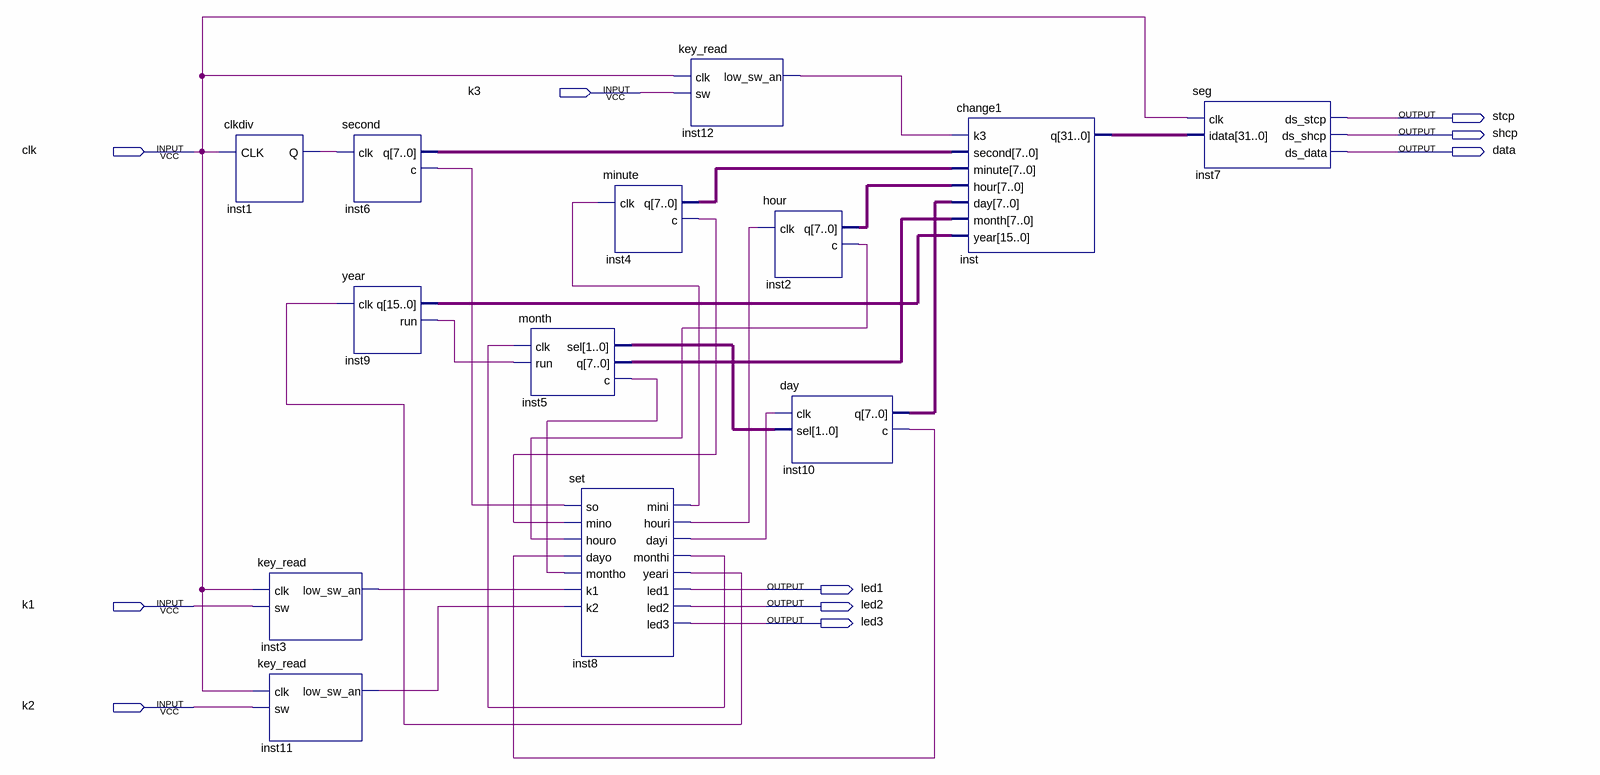
[diagram p0: schematic sheet]
// Quartus schematic clkdiv.bdf as structural Verilog: 13 symbols, 10 pins
module clkdiv (
  input  k3,
  input  clk,
  input  k1,
  input  k2,
  output stcp,
  output shcp,
  output data,
  output led1,
  output led2,
  output led3
);

  wire inst1_q, inst2_c, inst3_low_sw_an, inst4_c, inst5_c, inst6_c, inst8_dayi, inst8_houri, inst8_mini,
       inst8_monthi, inst8_yeari, inst9_run, inst10_c, inst11_low_sw_an, inst12_low_sw_an;
  wire [1:0] inst5_sel;
  wire [7:0] inst2_q, inst4_q, inst5_q, inst6_q, inst10_q;
  wire [15:0] inst9_q;
  wire [31:0] inst_q;

  clkdiv inst1 (.CLK(clk), .Q(inst1_q));
  key_read inst3 (.clk(clk), .sw(k1), .low_sw_an(inst3_low_sw_an));
  key_read inst11 (.clk(clk), .sw(k2), .low_sw_an(inst11_low_sw_an));
  second inst6 (.clk(inst1_q), .q(inst6_q), .c(inst6_c));
  year inst9 (.clk(inst8_yeari), .q(inst9_q), .run(inst9_run));
  month inst5 (.clk(inst8_monthi), .run(inst9_run), .sel(inst5_sel), .q(inst5_q), .c(inst5_c));
  set inst8 (
    .so(inst6_c), .mino(inst4_c), .houro(inst2_c), .dayo(inst10_c), .montho(inst5_c), .k1(inst3_low_sw_an),
    .k2(inst11_low_sw_an), .mini(inst8_mini), .houri(inst8_houri), .dayi(inst8_dayi), .monthi(inst8_monthi),
    .yeari(inst8_yeari), .led1(led1), .led2(led2), .led3(led3));
  minute inst4 (.clk(inst8_mini), .q(inst4_q), .c(inst4_c));
  key_read inst12 (.clk(clk), .sw(k3), .low_sw_an(inst12_low_sw_an));
  hour inst2 (.clk(inst8_houri), .q(inst2_q), .c(inst2_c));
  day inst10 (.clk(inst8_dayi), .sel(inst5_sel), .q(inst10_q), .c(inst10_c));
  change1 inst (
    .k3(inst12_low_sw_an), .second(inst6_q), .minute(inst4_q), .hour(inst2_q), .day(inst10_q),
    .month(inst5_q), .year(inst9_q), .q(inst_q));
  seg inst7 (.clk(clk), .idata(inst_q), .ds_stcp(stcp), .ds_shcp(shcp), .ds_data(data));
endmodule
